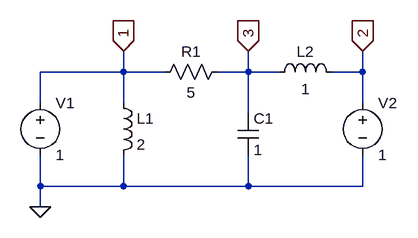
[diagram p0: schematic Two port circuit1.asc]
Two port circuit1.asc, the LTspice schematic file:
Version 4
SHEET 1 880 680
WIRE 128 80 128 48
WIRE 128 80 0 80
WIRE 192 80 128 80
WIRE 320 80 320 48
WIRE 320 80 272 80
WIRE 368 80 320 80
WIRE 496 80 496 48
WIRE 496 80 448 80
WIRE 0 128 0 80
WIRE 128 128 128 80
WIRE 496 128 496 80
WIRE 320 144 320 80
WIRE 0 256 0 208
WIRE 128 256 128 208
WIRE 128 256 0 256
WIRE 320 256 320 208
WIRE 320 256 128 256
WIRE 496 256 496 208
WIRE 496 256 320 256
WIRE 0 288 0 256
FLAG 0 288 0
FLAG 128 48 1
IOPIN 128 48 In
FLAG 320 48 3
IOPIN 320 48 In
FLAG 496 48 2
IOPIN 496 48 In
SYMBOL voltage 0 112 R0
WINDOW 123 0 0 Left 2
WINDOW 39 0 0 Left 2
SYMATTR InstName V1
SYMATTR Value 1
SYMBOL voltage 496 112 R0
WINDOW 123 0 0 Left 2
WINDOW 39 0 0 Left 2
SYMATTR InstName V2
SYMATTR Value 1
SYMBOL ind 112 112 R0
SYMATTR InstName L1
SYMATTR Value 2
SYMBOL ind 352 96 R270
WINDOW 0 32 56 VTop 2
WINDOW 3 5 56 VBottom 2
SYMATTR InstName L2
SYMATTR Value 1
SYMBOL res 176 96 R270
WINDOW 0 32 56 VTop 2
WINDOW 3 0 56 VBottom 2
SYMATTR InstName R1
SYMATTR Value 5
SYMBOL cap 304 144 R0
SYMATTR InstName C1
SYMATTR Value 1

The netlist it stands for:
* Two port circuit1.asc
V1 1 0 1
V2 2 0 1
L1 1 0 2
L2 3 2 1
R1 1 3 5
C1 3 0 1
.backanno
.end